# Altium schematic sheet ArduinoUnoShield.SchDoc
size A4
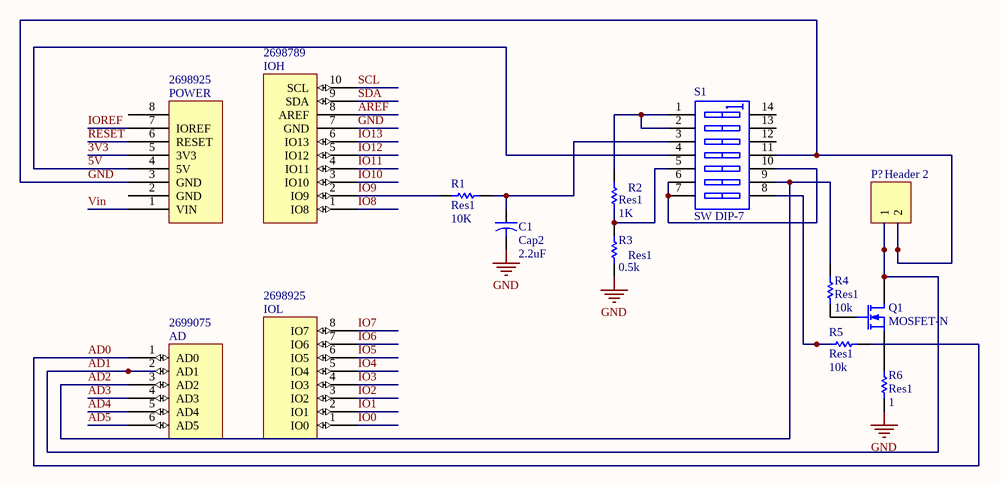
[diagram p0: ArduinoUnoShield.SchDoc]

## Parts
AD  Supplier Part Number 4: 2699075  [Header 6x1 8.5mm]  (hidden comment: AD)
C1  Cap2  value 2.2uF  [CAPR5-4X5]
IOH  Supplier Part Number 3: 2698789  [Header 10x1 8.5mm]  (hidden comment: IOH)
IOL  Supplier Part Number 4: 2698925  [Header 8x1 8.5mm]  (hidden comment: IOL)
P?  Header 2  [HDR1X2]
POWER  Supplier Part Number 4: 2698925  [Header 8x1 8.5mm]  (hidden comment: POWER_UNO)
Q1  MOSFET-N  [E3]
R1  Res1  value 10K  [AXIAL-0.3]
R2  Res1  value 1K  [AXIAL-0.3]
R3  Res1  value 0.5k  [AXIAL-0.3]
R4  Res1  value 10k  [AXIAL-0.3]
R5  Res1  value 10k  [AXIAL-0.3]
R6  Res1  value 1  [AXIAL-0.3]
S1  SW DIP-7  [DIP-14]

## Nets
GND: C1.2 IOH.7(GND) P?.2 POWER.3(GND) R3.2 R6.2 S1.11(B4)
3V3: POWER.5(3V3)
5V: POWER.4(5V) S1.4(A4)
AD0: AD.1(AD0) R5.2
AD1: AD.2(AD1) P?.1 Q1.1(D)
AD2: AD.3(AD2) R4.2 S1.9(B6)
AD3: AD.4(AD3)
AD4: AD.5(AD4)
AD5: AD.6(AD5)
AREF: IOH.8(AREF)
IO0: IOL.1(IO0)
IO1: IOL.2(IO1)
IO2: IOL.3(IO2)
IO3: IOL.4(IO3)
IO4: IOL.5(IO4)
IO5: IOL.6(IO5)
IO6: IOL.7(IO6)
IO7: IOL.8(IO7)
IO8: IOH.1(IO8)
IO9: IOH.2(IO9) R1.1
IO10: IOH.3(IO10)
IO11: IOH.4(IO11)
IO12: IOH.5(IO12)
IO13: IOH.6(IO13)
IOREF: POWER.7(IOREF)
RESET: POWER.6(RESET)
SCL: IOH.10(SCL)
SDA: IOH.9(SDA)
Vin: POWER.1(VIN)
NetC1_1: C1.1 R1.2 S1.3(A3)
NetQ1_2: Q1.2(G) R4.1
NetQ1_3: Q1.3(S) R6.1
NetR2_1: R2.1 R3.1 S1.5(A5)
NetR2_2: R2.2 S1.1(A1) S1.2(A2)
NetR5_1: R5.1 S1.8(B7)
NetS1_6: S1.6(A6) S1.7(A7) S1.10(B5)

Not connected (* = marked no-connect by the designer): POWER 2(GND) 8; S1 12(B3) 13(B2) 14(B1)

## Library data of the parts
C1 = Cap2: Capacitor; Published: 23-Sep-2002; PackageReference: CAPR5-4X5; Publisher: Altium Limited; PackageDescription: Capacitor; 2 Leads
P? = Header 2: Header, 2-Pin; LatestRevisionDate: 17-Jul-2002; LatestRevisionNote: Re-released for DXP Platform.; Publisher: Altium Limited
Q1 = MOSFET-N: N-Channel MOSFET; Published: 8-Jun-2000; LatestRevisionDate: 17-Jul-2002; LatestRevisionNote: Re-released for DXP Platform.; PackageVersion: 1995/1996; PackageReference: E3; Publisher: Altium Limited; PackageDescription: TO, Flat Index; 3 In-Line, Axial Leads; Body Dia. 4.6mm; Lead Dia. 0.5 mm (max)
R1-R6 = Res1: Resistor; Published: 8-Jun-2000; LatestRevisionDate: 17-Jul-2002; LatestRevisionNote: Re-released for DXP Platform.; PackageReference: AXIAL-0.3; Publisher: Altium Limited; PackageDescription: Axial Device, Thru-Hole; 2 Leads; 0.3 in Pin Spacing
S1 = SW DIP-7: DIP Switch, 7 Position, SPST; Published: 24-Mar-1999; LatestRevisionDate: 17-Jul-2002; LatestRevisionNote: Re-released for DXP Platform.; PackageReference: DIP-14; Publisher: Altium Limited; Code_JEDEC: MO-001-AF
AD = AD: Supplier 1: Arrow; Supplier Part Number 1: 2699089; Supplier 2: Digi-Key; Supplier Part Number 2: SAM1198-06-ND; Supplier 3: Arrow; Supplier Part Number 3: 2699088; Supplier 4: Arrow
IOH = IOH: Supplier 1: Arrow; Supplier Part Number 1: 2698803S4475693N1004; Supplier 2: Digi-Key; Supplier Part Number 2: SAM1198-10-ND; Supplier 3: Arrow
IOL = IOL: Supplier 1: Digi-Key; Supplier Part Number 1: SAM1198-08-ND; Supplier 2: Arrow; Supplier Part Number 2: 2698939; Supplier 3: Arrow; Supplier Part Number 3: 2698940; Supplier 4: Arrow
POWER = POWER_UNO: Supplier 1: Digi-Key; Supplier Part Number 1: SAM1198-08-ND; Supplier 2: Arrow; Supplier Part Number 2: 2698939; Supplier 3: Arrow; Supplier Part Number 3: 2698940; Supplier 4: Arrow